# EAGLE design Arduino_Micro_Rev03j (EAGLE 7.2.0)
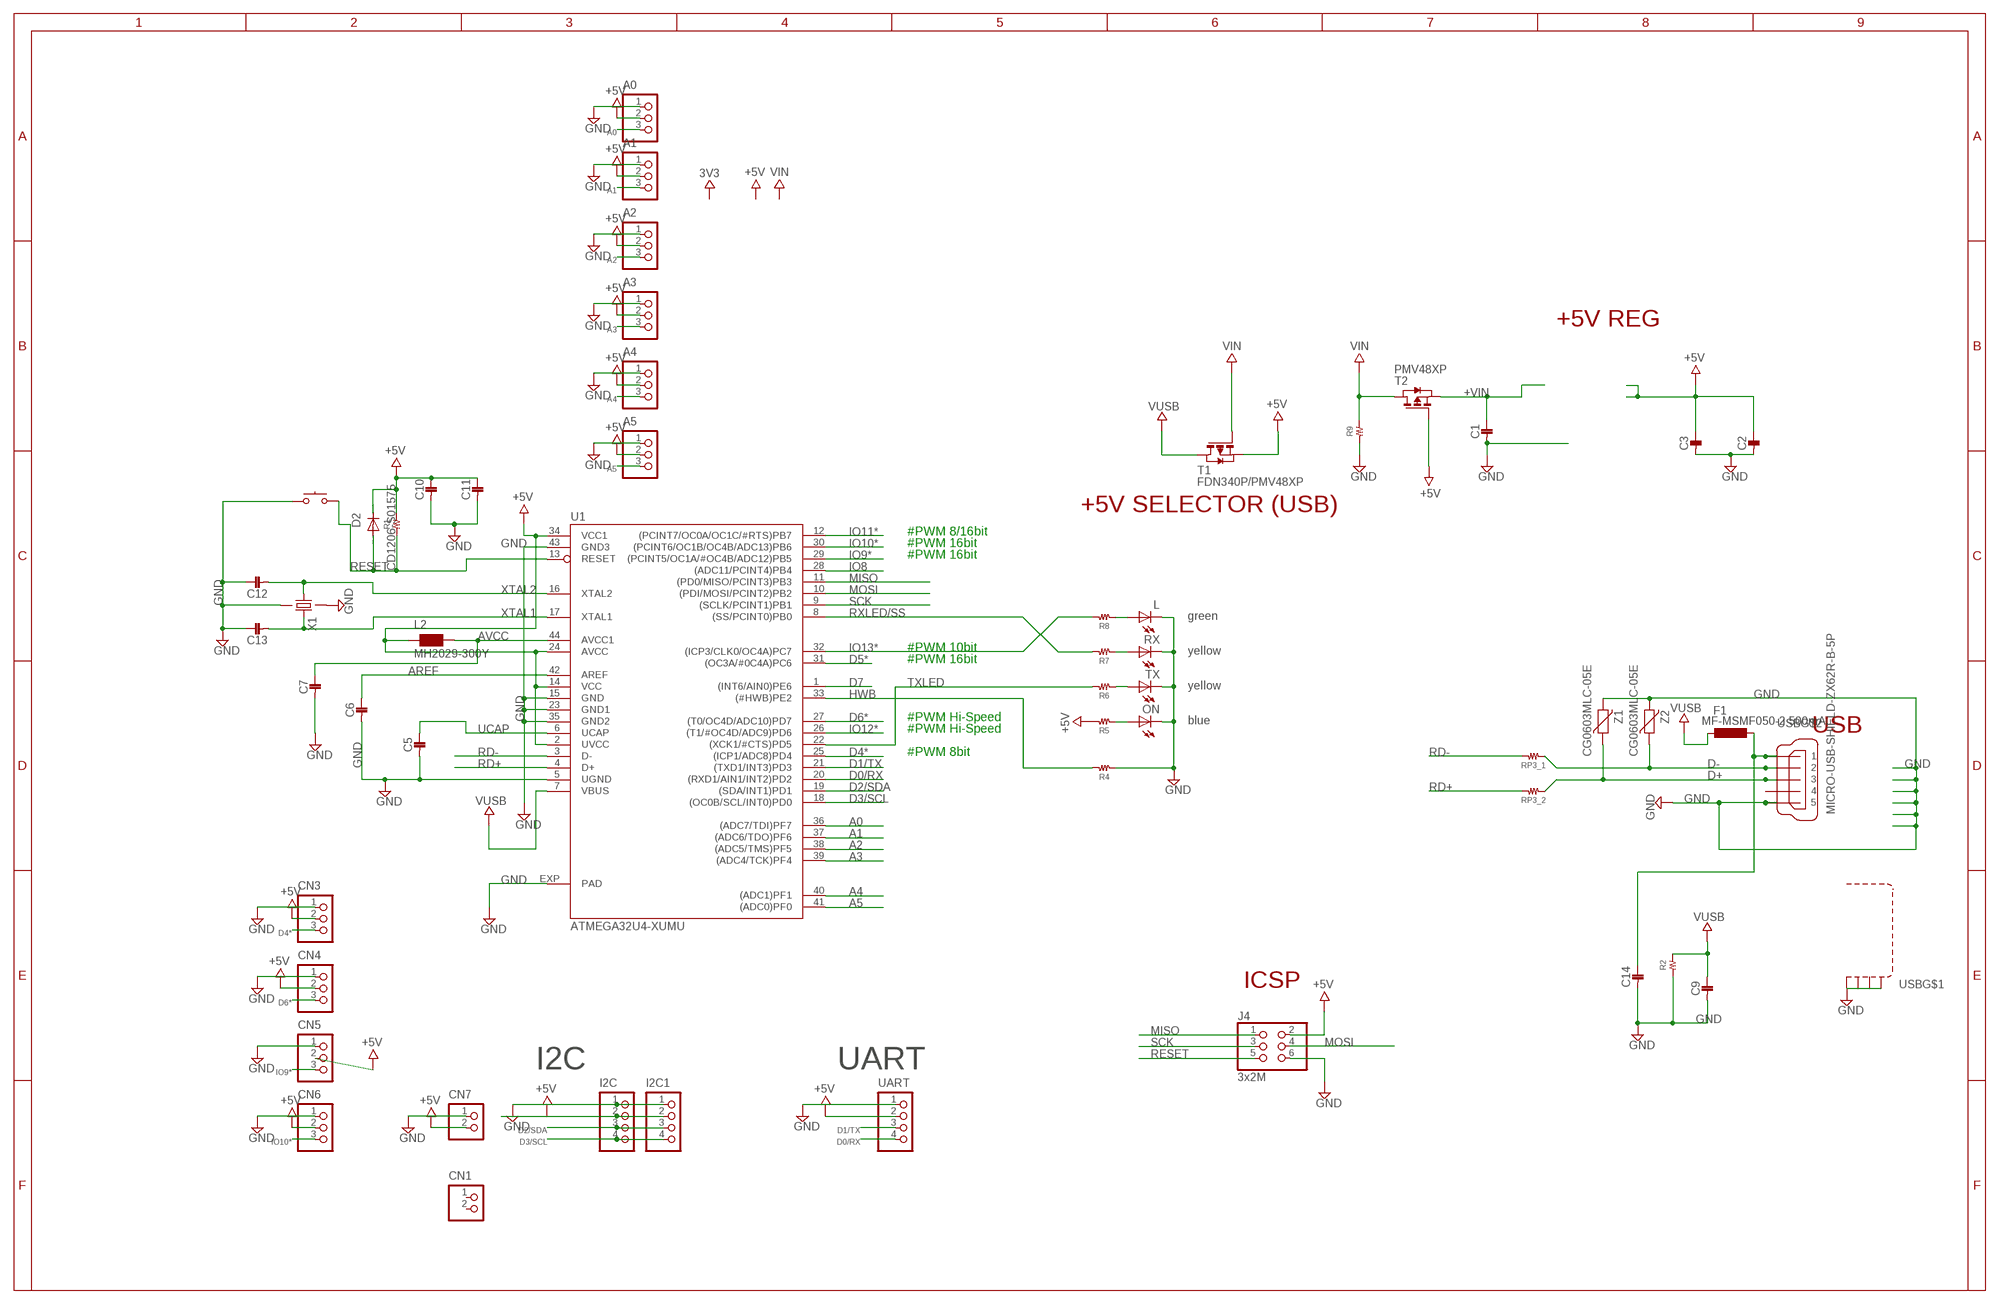
[diagram p0: schematic, sheet 1]

## Parts
A0  B3B-PH-K-S  [B3B-PH-K-S]
A1  B3B-PH-K-S  [B3B-PH-K-S]
A2  B3B-PH-K-S  [B3B-PH-K-S]
A3  B3B-PH-K-S  [B3B-PH-K-S]
A4  B3B-PH-K-S  [B3B-PH-K-S]
A5  B3B-PH-K-S  [B3B-PH-K-S]
C1  1608  [1608]
C2  1608  [1608]
C3  3216  [3216]
C5  1608  [1608]
C6  1608  [1608]
C7  1608  [1608]
C9  1608  [1608]
C10  1608  [1608]
C11  1608  [1608]
C12  1608  [1608]
C13  1608  [1608]
C14  3216  [3216]
CN1  B2B-PH-K-S  [B2B-PH-K-S]
CN3  B3B-PH-K-S  [B3B-PH-K-S]
CN4  B3B-PH-K-S  [B3B-PH-K-S]
CN5  B3B-PH-K-S  [B3B-PH-K-S]
CN6  B3B-PH-K-S  [B3B-PH-K-S]
CN7  B2B-PH-K-S  [B2B-PH-K-S]
D2  CD1206-S01575  DIODE-MINIMELF  [MINIMELF]
F1  MF-MSMF050-2 500mA  L-EUL1812  [L1812]
I2C  B4B-PH-K-S  [B4B-PH-K-S]
I2C1  B4B-PH-K-S  [B4B-PH-K-S]
J4  3x2M  PINHD-2X3  [2X03]
L  green  LEDCHIPLED_0805  [CHIPLED_0805]
L2  MH2029-300Y  WE-CBF_0805  [0805]
ON  blue  LEDCHIPLED_0805  [CHIPLED_0805]
R1  RESISTOR__SMD  [1608]
R2  RESISTOR__SMD  [1608]
R4  RESISTOR__SMD  [1608]
R5  RESISTOR__SMD  [1608]
R6  RESISTOR__SMD  [1608]
R7  RESISTOR__SMD  [1608]
R8  RESISTOR__SMD  [1608]
R9  RESISTOR__SMD  [1608]
RESET  SKRPACE010  [SKRP]
RP3_1  RESISTOR__SMD  [1608]
RP3_2  RESISTOR__SMD  [1608]
RX  yellow  LEDCHIPLED_0805  [CHIPLED_0805]
T1  FDN340P/PMV48XP  PMOSSOT23  [SOT-23]
T2  PMV48XP  PMOSSOT23  [SOT-23]
TX  yellow  LEDCHIPLED_0805  [CHIPLED_0805]
U1  ATMEGA32U4-XUMU  [QFN44ML7X7]
UART  B4B-PH-K-S  [B4B-PH-K-S]
USB  MICRO-USB-SHIELD-ZX62R-B-5P  [ZX62R-B-5P]
X1  X22  [SMD_X22]
Z1  CG0603MLC-05E  VARISTORCN0603  [CT/CN0603]
Z2  CG0603MLC-05E  VARISTORCN0603  [CT/CN0603]

## Nets
+5V: A0.2 A1.2 A2.2 A3.2 A4.2 A5.2 C2.P$1 C3.P$1 C10.P$1 C11.P$1 CN3.2 CN4.2 CN5.2 CN6.2 CN7.2 D2.C I2C1.2 I2C.2 J4.2 L2.1 R1.2 R5.2 T1.2(S) T2.3(G) U1.2(UVCC) U1.14(VCC) U1.24(AVCC) U1.34(VCC1) UART.2
+VIN: C1.P$1 T2.2(S)
A0: A0.3 U1.36((ADC7/TDI)PF7)
A1: A1.3 U1.37((ADC6/TDO)PF6)
A2: A2.3 U1.38((ADC5/TMS)PF5)
A3: A3.3 U1.39((ADC4/TCK)PF4)
A4: A4.3 U1.40((ADC1)PF1)
A5: A5.3 U1.41((ADC0)PF0)
AREF: C6.P$1 U1.42(AREF)
AVCC: C7.P$1 L2.2 U1.44(AVCC1)
D0/RX: U1.20((RXD1/AIN1/INT2)PD2) UART.4
D1/TX: U1.21((TXD1/INT3)PD3) UART.3
D2/SDA: I2C1.3 I2C.3 U1.19((SDA/INT1)PD1)
D3/SCL: I2C1.4 I2C.4 U1.18((OC0B/SCL/INT0)PD0)
D4*: CN3.3 U1.25((ICP1/ADC8)PD4)
D5*: U1.31((OC3A/#0C4A)PC6)
D6*: CN4.3 U1.27((T0/OC4D/ADC10)PD7)
D7: U1.1((INT6/AIN0)PE6)
D+: RP3_2.1 USB.3 Z1.1
D-: RP3_1.1 USB.2 Z2.1
GND: A0.1 A1.1 A2.1 A3.1 A4.1 A5.1 C1.P$2 C2.P$2 C3.P$2 C5.P$2 C6.P$2 C7.P$2 C9.P$2 C10.P$2 C11.P$2 C12.P$1 C13.P$1 C14.P$2 CN3.1 CN4.1 CN5.1 CN6.1 CN7.1 I2C1.1 I2C.1 J4.6 L.C ON.C R2.1 R4.1 R9.1 RESET.3 RESET.4 RX.C TX.C U1.5(UGND) U1.15(GND) U1.23(GND1) U1.35(GND2) U1.43(GND3) U1.EXP(PAD) UART.1 USB.5 USB.M1(S1) USB.M2(S2) USB.M3(S3) USB.M4(S4) X1.2 X1.4 Z1.2 Z2.2
HWB: R4.2 U1.33((#HWB)PE2)
IO8: U1.28((ADC11/PCINT4)PB4)
IO9*: CN5.3 U1.29((PCINT5/OC1A/#OC4B/ADC12)PB5)
IO10*: CN6.3 U1.30((PCINT6/OC1B/OC4B/ADC13)PB6)
IO11*: U1.12((PCINT7/OC0A/OC1C/#RTS)PB7)
IO12*: U1.26((T1/#OC4D/ADC9)PD6)
IO13*: R8.2 U1.32((ICP3/CLK0/OC4A)PC7)
MISO: J4.1 U1.11((PD0/MISO/PCINT3)PB3)
MOSI: J4.4 U1.10((PDI/MOSI/PCINT2)PB2)
N$2: R7.1 RX.A
N$3: ON.A R5.1
N$4: R6.1 TX.A
N$7: L.A R8.1
RD+: RP3_2.2 U1.4(D+)
RD-: RP3_1.2 U1.3(D-)
RESET: D2.A J4.5 R1.1 RESET.1 RESET.2 U1.13(RESET)
RXLED/SS: R7.2 U1.8((SS/PCINT0)PB0)
SCK: J4.3 U1.9((SCLK/PCINT1)PB1)
TXLED: R6.2 U1.22((XCK1/#CTS)PD5)
UCAP: C5.P$1 U1.6(UCAP)
VIN: R9.2 T1.3(G) T2.1(D)
VUSB: C9.P$1 F1.2 R2.2 T1.1(D) U1.7(VBUS)
VUSBD: C14.P$1 F1.1 USB.1
XTAL1: C13.P$2 U1.17(XTAL1) X1.3
XTAL2: C12.P$2 U1.16(XTAL2) X1.1
Unconnected: CN1.1 CN1.2 USB.4

## Notes on the sheet
- +5V REG
- +5V SELECTOR (USB)
- #PWM 8/16bit
- #PWM 16bit
- #PWM 16bit
- #PWM 10bit
- #PWM 16bit
- #PWM Hi-Speed
- #PWM Hi-Speed | USB
- #PWM 8bit
- ICSP
- I2C | UART

## Library data of the parts
A0 A1-A5 CN3-CN6 = jst-pa:B3B-PH-*: Wire-to-Board 2.0mm pitch top mount connector Source: http://www.jst-mfg.com/product/pdf/jpn/PH.pdf http://www.jst-mfg.com/product/detail.php?series=199
C1 C2 C5-C7 C9-C13 = 02_C:1608
C3 C14 = 02_C:3216
CN1 CN7 = jst-pa:B2B-PH-*: Wire-to-Board 2.0mm pitch top mount connector Source: http://www.jst-mfg.com/product/pdf/jpn/PH.pdf http://www.jst-mfg.com/product/detail.php?series=199
D2 = diode:DIODE-: DIODE
F1 = rcl:L-EU: INDUCTOR, European symbol
I2C I2C1 UART = jst-pa:B4B-PH-*: Wire-to-Board 2.0mm pitch top mount connector Source: http://www.jst-mfg.com/product/pdf/jpn/PH.pdf http://www.jst-mfg.com/product/detail.php?series=199
J4 = SmartPrj:PINHD-2X3: PIN HEADER
L ON RX TX = led:LED: LED OSRAM: - CHIPLED LG R971, LG N971, LY N971, LG Q971, LY Q971, LO R971, LY R971 LH N974, LH R974 LS Q976, LO Q976, LY Q976 LO Q996 - Hyper CHIPLED LW Q18S LB Q993, LB Q99A, LB R99A - SideLED LS A670, LO A670, LY A670, LG A670, LP A670 LB A673, LV A673, LT A673, LW A673 LH A674 LY A675 LS A676, LA A676, LO A676, LY A676, LW A676 LS A679, LY A679, LG A679 - Hyper Micro SIDELED® LS Y876, LA Y876, LO Y876, LY Y876 LT Y87S - SmartLED LW L88C, LW L88S LB L89C, LB L89S, LG L890 LS L89K, LO L89K, LY L89K LS L896, LA L896, LO L896, LY L896 - TOPLED LS T670, LO T670, LY T670, LG T670, LP T670 LSG T670, LSP T670, LSY T670, LOP T670, LYG T670 LG T671, LOG T671, LSG T671 LB T673, LV T673, LT T673, LW T673 LH T674 LS T676, LA T676, LO T676, LY T676, LB T676, LH T676, LSB T676, LW T676 LB T67C, LV T67C, LT T67C, LS T67K, LO T67K, LY T67K, LW E67C LS E67B, LA E67B, LO E67B, LY E67B, LB E67C, LV E67C, LT E67C LW T67C LS T679, LY T679, LG T679 LS T770, LO T770, LY T770, LG T770, LP T770 LB T773, LV T773, LT T773, LW T773 LH T774 LS E675, LA E675, LY E675, LS T675 LS T776, LA T776, LO T776, LY T776, LB T776 LHGB T686 LT T68C, LB T68C - Hyper Mini TOPLED® LB M676 - Mini TOPLED Santana® LG M470 LS M47K, LO M47K, LY M47K Source: http://www.osram.convergy.de LUXEON: - LUMILED® LXK2-PW12-R00, LXK2-PW12-S00, LXK2-PW14-U00, LXK2-PW14-V00 LXK2-PM12-R00, LXK2-PM12-S00, LXK2-PM14-U00 LXK2-PE12-Q00, LXK2-PE12-R00, LXK2-PE12-S00, LXK2-PE14-T00, LXK2-PE14-U00 LXK2-PB12-K00, LXK2-PB12-L00, LXK2-PB12-M00, LXK2-PB14-N00, LXK2-PB14-P00, LXK2-PB14-Q00 LXK2-PR12-L00, LXK2-PR12-M00, LXK2-PR14-Q00, LXK2-PR14-R00 LXK2-PD12-Q00, LXK2-PD12-R00, LXK2-PD12-S00 LXK2-PH12-R00, LXK2-PH12-S00 LXK2-PL12-P00, LXK2-PL12-Q00, LXK2-PL12-R00 Source: www.luxeon.com KINGBRIGHT: KA-3528ASYC Source: www.kingbright.com
L2 = wuerth-elektronik:WE-CBF: SMD EMI Suppression Ferrite Beads - excellent anti-EMI properties - low DCR - impedances till 3000 ohms - rated current up to 6 A
R1 R2 R4-R9 RP3_1 RP3_2 = 01_R:RESISTOR__SMD
RESET = 09_1_switch:SKRPACE010
T1 T2 = zetex:PMOSSOT23: MOS FET; OC_FARNELL: unknown; OC_NEWARK: unknown
U1 = SmartPrj:ATMEGA32U4-XU
USB = con-hirose1:MICRO-USB-SHIELD-: Hirose Micro USB Connector ZX62R-B-5P: Micro B, reverse (top mount) shell SMT Supplier: DigiKey H11574CT-ND Source: http://www.hirose.co.jp/cataloge_hp/e24200011.pdf
X1 = 09_2_CRYSTAL:X22
Z1 Z2 = varistor:VARISTOR: VARISTOR

## Net classes
0 default: width 0.254 mm, drill 0.61 mm, clearance 0.203 mm

## Board
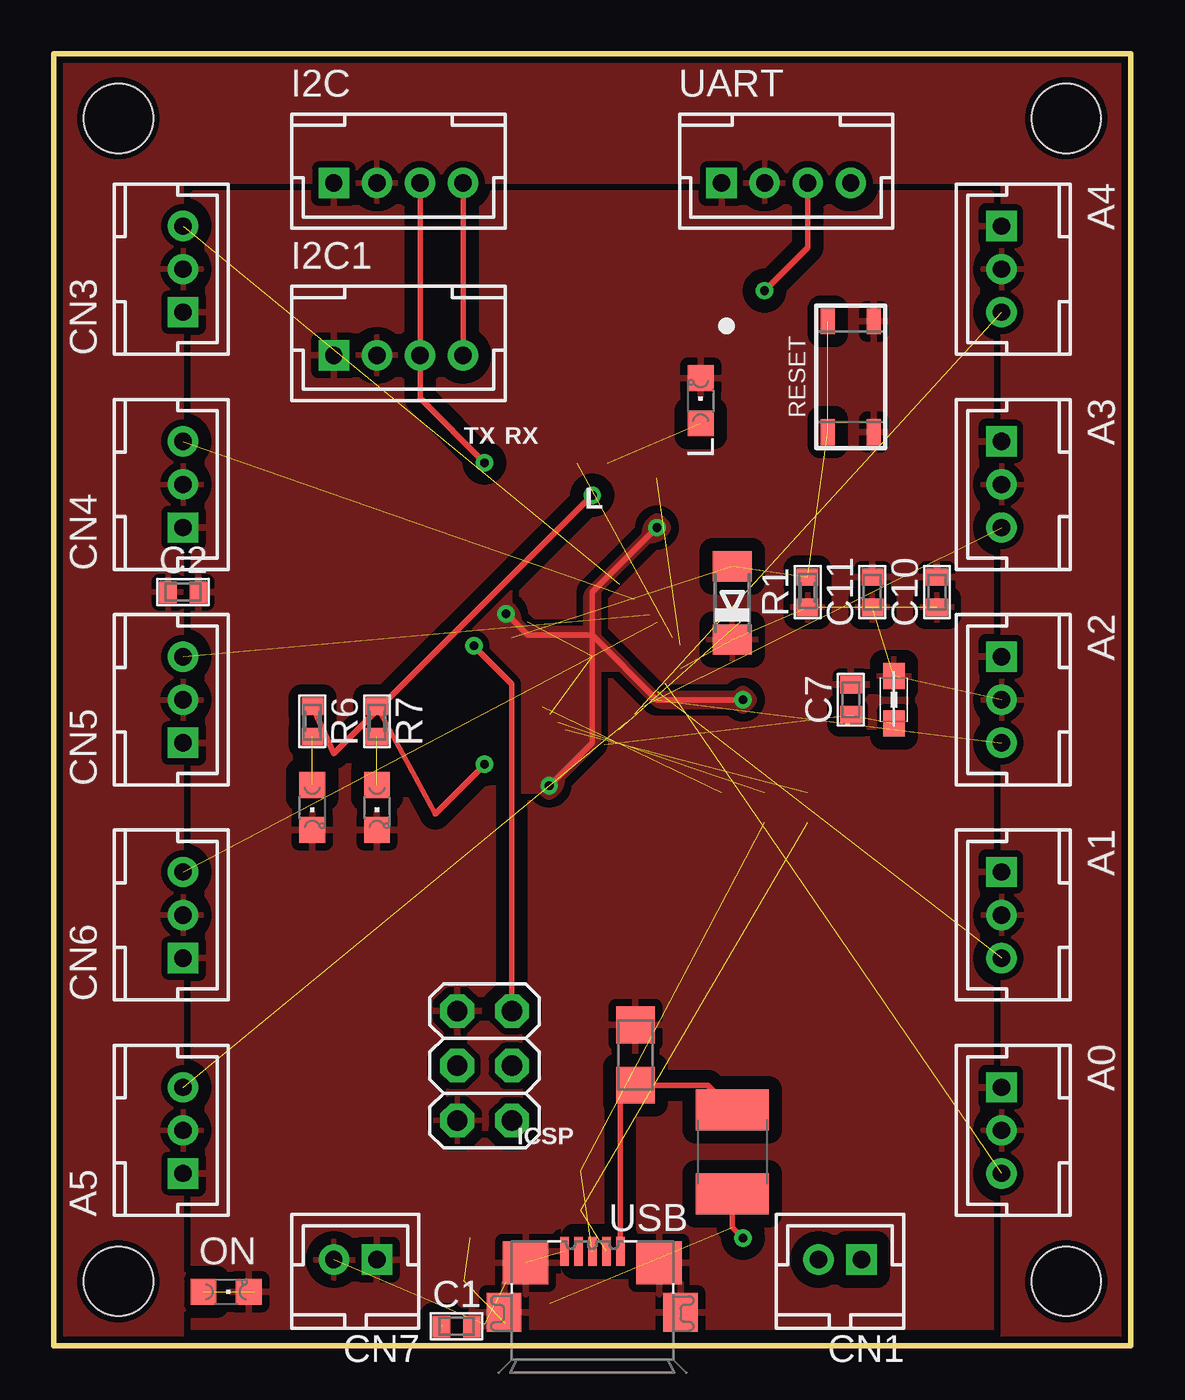
[diagram p1: board, top side]
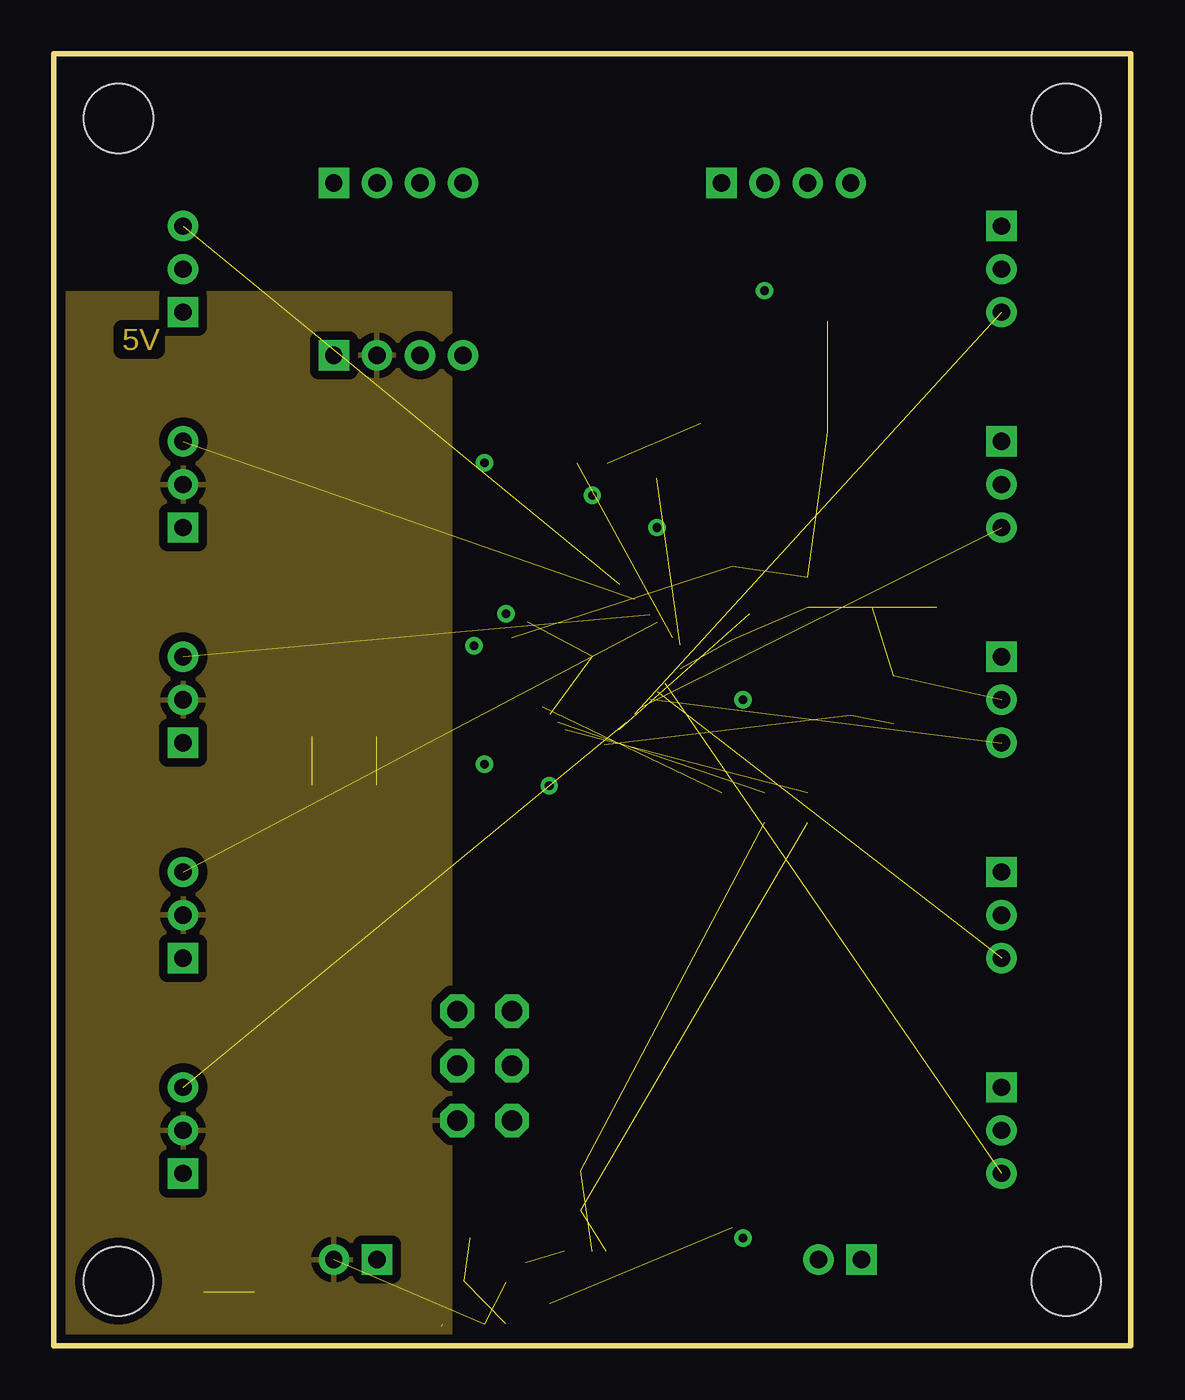
[diagram p2: board, inner layer POWER]
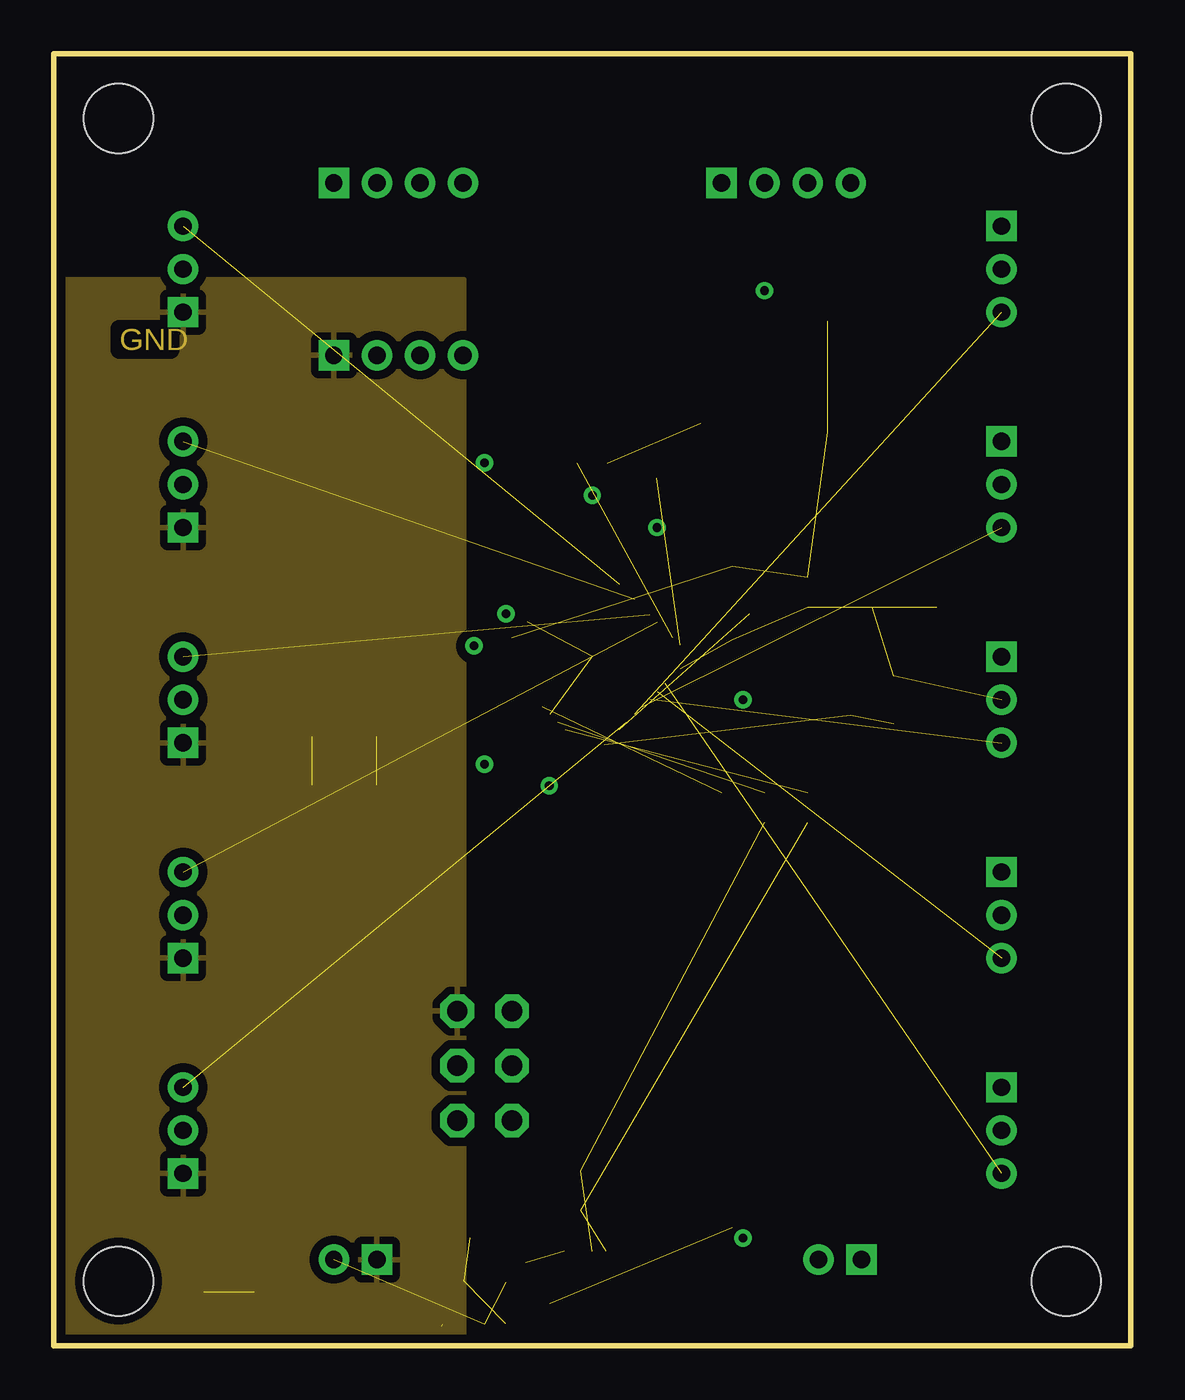
[diagram p3: board, inner layer GROUND]
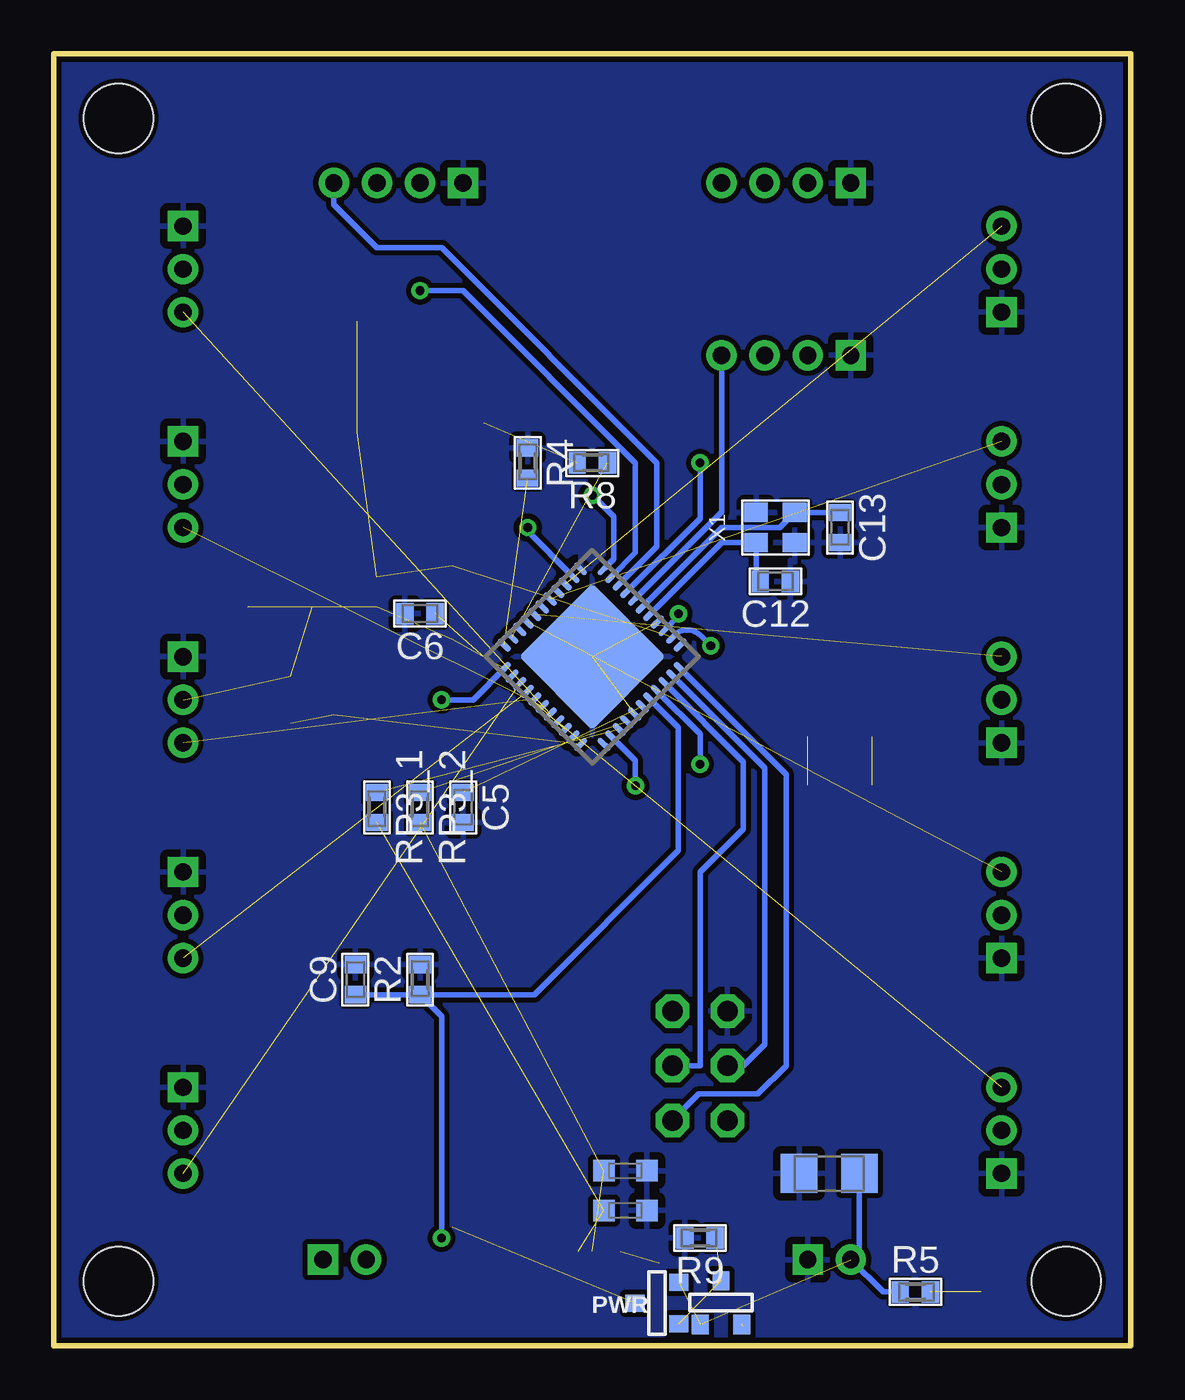
[diagram p4: board, bottom side, seen from below]

Size 50 x 60 mm. Coordinates in mm from the lower left corner, seen from the top.
Outline: 0,0 50,0 50,60 0,60 0,0
Copper layers (1*2+15*16): Top 0.035mm / dielectric 0.5mm / POWER 0.035mm / dielectric 0.4mm / GROUND 0.035mm / dielectric 0.5mm / Bottom 0.035mm
Design rules "default": minimum track width 8mil, minimum drill 18mil, track to track 8mil, track to pad 8mil, pad to pad 8mil, via to via 8mil, smd to smd 7mil, copper to edge 8mil, drill to drill 8mil, minimum pad ring 12mil, minimum via ring 8mil, stop-mask expansion 1mil, vias tented up to drill 20mil, thermal gap 14mil
Holes 3.2 mm at 3,3 47,3 47,57 3,57

### Footprints (pad centres in the part's own frame; a part is rotated, then mirrored left to right if it is on the bottom)
B3B-PH-K-S = drill 0.8 square: 1 -2,0 | drill 0.8: 2 0,0; 3 2,0
1608 = smd 0.8 x 1: P$1 -0.7,0; P$2 0.7,0
3216 = smd 1.7 x 1.8: P$1 -1.4,0; P$2 1.4,0
B2B-PH-K-S = drill 0.8 square: 1 -1,0 | drill 0.8: 2 1,0
MINIMELF = smd 1.4 x 1.8: A 1.7,0; C -1.7,0
L1812 = smd 1.9 x 3.4: 1 -1.95,0; 2 1.95,0
B4B-PH-K-S = drill 0.8 square: 1 -3,0 | drill 0.8: 2 -1,0; 3 1,0; 4 3,0
2X03 = drill 0.95 pad 1.55 octagon: 1 -2.54,-1.27; 2 -2.54,1.27; 3 0,-1.27; 4 0,1.27; 5 2.54,-1.27; 6 2.54,1.27
CHIPLED_0805 = smd 1.2 x 1.2: A 0,-1.05; C 0,1.05
0805 = smd 1.2 x 1: 1 -1.1,0; 2 1.1,0
1608' = smd 0.8 x 1: 1 -0.7,0; 2 0.7,0
SKRP = smd 1.2 x 0.65: 1 -2.575,1.075; 2 2.575,1.075; 3 -2.575,-1.075; 4 2.575,-1.075
SOT-23 = smd 0.787 x 0.889: 1 0.025,-1.016; 2 -0.94,1.016; 3 0.991,1.016
QFN44ML7X7 = smd 0.75 x 0.275: 1 -3.275,2.5; 2 -3.275,2; 3 -3.275,1.5; 4 -3.275,1; 5 -3.275,0.5; 6 -3.275,0; 7 -3.275,-0.5; 8 -3.275,-1; 9 -3.275,-1.5; 10 -3.275,-2; 11 -3.275,-2.5; 23 3.275,-2.5; 24 3.275,-2; 25 3.275,-1.5; 26 3.275,-1; 27 3.275,-0.5; 28 3.275,0; 29 3.275,0.5; 30 3.275,1; 31 3.275,1.5; 32 3.275,2; 33 3.275,2.5 | smd 0.275 x 0.75: 12 -2.5,-3.275; 13 -2,-3.275; 14 -1.5,-3.275; 15 -1,-3.275; 16 -0.5,-3.275; 17 0,-3.275; 18 0.5,-3.275; 19 1,-3.275; 20 1.5,-3.275; 21 2,-3.275; 22 2.5,-3.275; 34 2.5,3.275; 35 2,3.275; 36 1.5,3.275; 37 1,3.275; 38 0.5,3.275; 39 0,3.275; 40 -0.5,3.275; 41 -1,3.275; 42 -1.5,3.275; 43 -2,3.275; 44 -2.5,3.275 | smd 4.826 x 4.826: EXP 0,0
ZX62R-B-5P = smd 1.35 x 0.4: 1 2.875,-1.3; 2 2.875,-0.65; 3 2.875,0; 4 2.875,0.65; 5 2.875,1.3 | smd 1.8 x 1.6: M1 0.05,-4.1; M2 0.05,4.1 | smd 2 x 2.1: M3 2.35,3.1; M4 2.35,-3.1
SMD_X22 = smd 1.1 x 0.9: 1 -0.9,-0.7; 2 0.9,-0.7; 3 0.9,0.7; 4 -0.9,0.7
CT/CN0603 = smd 1 x 1: 1 -1,0; 2 1,0

### Placement (x,y rotation side)
A0  44,10 270 top
A1  44,20 270 top
A2  44,30 270 top
A3  44,40 270 top
A4  44,50 270 top
A5  6,10 90 top
C1  18.7,0.9 0 top
C2  6,35 0 top
C3  14,8 180 bottom
C5  31,25 270 bottom
C6  33,34 180 bottom
C7  37,30 90 top
C9  36,17 90 bottom
C10  41,35 90 top
C11  38,35 90 top
C12  16.5,35.5 180 bottom
C13  13.5,38 90 bottom
C14  27,13.5 90 top
CN1  36.5,4 180 top
CN3  6,50 90 top
CN4  6,40 90 top
CN5  6,30 90 top
CN6  6,20 90 top
CN7  14,4 180 top
D2  31.5,34.5 90 top
F1  31.5,9 270 top
I2C  16,54 0 top
I2C1  16,46 0 top
J4  20,13 90 top
L  30.03,43.89 0 top
L2  39,30 270 top
ON  8,2.5 270 top
R1  [1608']  35,35 270 top
R2  [1608']  33,17 270 bottom
R4  [1608']  28,41 270 bottom
R5  [1608']  10,2.5 180 bottom
R6  [1608']  12,29 90 top
R7  [1608']  15,29 90 top
R8  [1608']  25,41 0 bottom
R9  [1608']  20,5 0 bottom
RESET  37,45 90 top
RP3_1  [1608']  35,25 90 bottom
RP3_2  [1608']  33,25 90 bottom
RX  15,25 180 top
T1  22,2 270 bottom
T2  19,2 180 bottom
TX  12,25 180 top
U1  25,32 135 bottom
UART  34,54 0 top
USB  25,1.5 90 top
X1  16.5,38 0 bottom
Z1  23.47,8.13 0 bottom
Z2  23.47,6.28 0 bottom

### Tracks (layer width: path | path; a pad name or v marks a point on that pad's centre or on a via)
+5V  (via drill 0.4)  (8 unrouted)
  Top 0.25: v21,34 22,33 25,33 | 25,33 28,30 v32,30 | v28,38 25,35 25,33 | v23,26 25,28 25,33
  Bottom 0.25: U1.14 21,33.88 v21,34 | v32,30 30.54,30 U1.34 | U1.24 28,37.83 v28,38 | U1.2 23,27.17 v23,26 | C3.P$1 12.6,4.4 CN7.2 11.5,2.5 R5.2
  pour POWER (isolate 0.406): -0.64,48.9 18.41,48.9 18.41,-0.64 -0.64,-0.64
  pour Top (isolate 0.305, rank 3): -2.54,62.8 52.32,62.8 52.32,-2.54 -2.54,-2.54
+VIN  (1 unrouted)
A0  (1 unrouted)
A1  (1 unrouted)
A2  (1 unrouted)
A3  (1 unrouted)
A4  (1 unrouted)
A5  (1 unrouted)
AREF  (1 unrouted)
AVCC  (2 unrouted)
D0/RX
  Bottom 0.25: U1.20 22,37.12 22,41 32,51 35,51 37,53 UART.4
D1/TX  (via drill 0.4)
  Top 0.25: v33,49 35,51 UART.3
  Bottom 0.25: U1.21 23,36.83 23,41 31,49 v33,49
D2/SDA  (via drill 0.4)
  Top 0.25: v20,41 17,44 I2C1.3 I2C.3
  Bottom 0.25: U1.19 20,38.41 v20,41
D3/SCL
  Top 0.25: I2C1.4 I2C.4
  Bottom 0.25: U1.18 19,38.71 I2C1.4
D4*  (1 unrouted)
D6*  (1 unrouted)
D+  (2 unrouted)
D-  (2 unrouted)
GND  (3 unrouted)
  pour GROUND (isolate 0.406): -1.27,49.53 19.05,49.53 19.05,-1.27 -1.27,-1.27
  pour Bottom (isolate 0.24): 51.69,62.16 -1.91,62.16 -1.91,-1.91 51.69,-1.91
  pour Top (isolate 0.61, rank 2): 6.5,53.5 43.5,53.5 43.5,0.5 6.5,0.5
HWB  (1 unrouted)
IO9*  (1 unrouted)
IO10*  (1 unrouted)
IO13*  (1 unrouted)
MISO
  Bottom 0.25: U1.11 16,26.54 16,13 17.32,11.68 20.07,11.68 21.27,10.48 J4.1
MOSI
  Bottom 0.25: U1.10 17,26.83 17,14 18,13 J4.4
N$2  (1 unrouted)
N$3  (1 unrouted)
N$4  (1 unrouted)
N$7  (1 unrouted)
RD+  (1 unrouted)
RD-  (1 unrouted)
RESET  (via drill 0.4)  (4 unrouted)
  Top 0.25: J4.5 21.27,30.73 v19.5,32.5
  Bottom 0.25: v19.5,32.5 20,33 arc-99 U1.13
RXLED/SS  (via drill 0.4)
  Top 0.25: R7.2 17.7,24.7 v20,27
  Bottom 0.25: v20,27 20,28.41 U1.8
SCK
  Bottom 0.25: U1.9 18,27.12 18,24 20,22 20,13 J4.3
TXLED  (via drill 0.4)
  Top 0.25: v25,39.5 13,27.5 R6.2
  Bottom 0.25: U1.22 24,36.54 24,38.5 v25,39.5
UCAP  (1 unrouted)
VIN  (2 unrouted)
VUSB  (via drill 0.4)  (1 unrouted)
  Top 0.25: v32,5 31.5,5.5 F1.2
  Bottom 0.25: U1.7 21,28.71 21,23 27.7,16.3 R2.2 | R2.2 C9.P$1 | R2.2 32,15.3 v32,5
VUSBD
  Top 0.25: F1.1 30.35,12.1 C14.P$1 26.3,11.4 USB.1
XTAL1
  Bottom 0.25: U1.17 19,38 16.3,38 X1.3 C13.P$2
XTAL2
  Bottom 0.25: U1.16 18.99,37.3 X1.1 17.4,35.7 C12.P$2

### Text on the board
POWER: 5V
GROUND: GND
tPlace: TX | RX | L | ICSP
bPlace: PWR